# EAGLE design Arduino_MEGA2560 shield new (EAGLE 7.1.0)
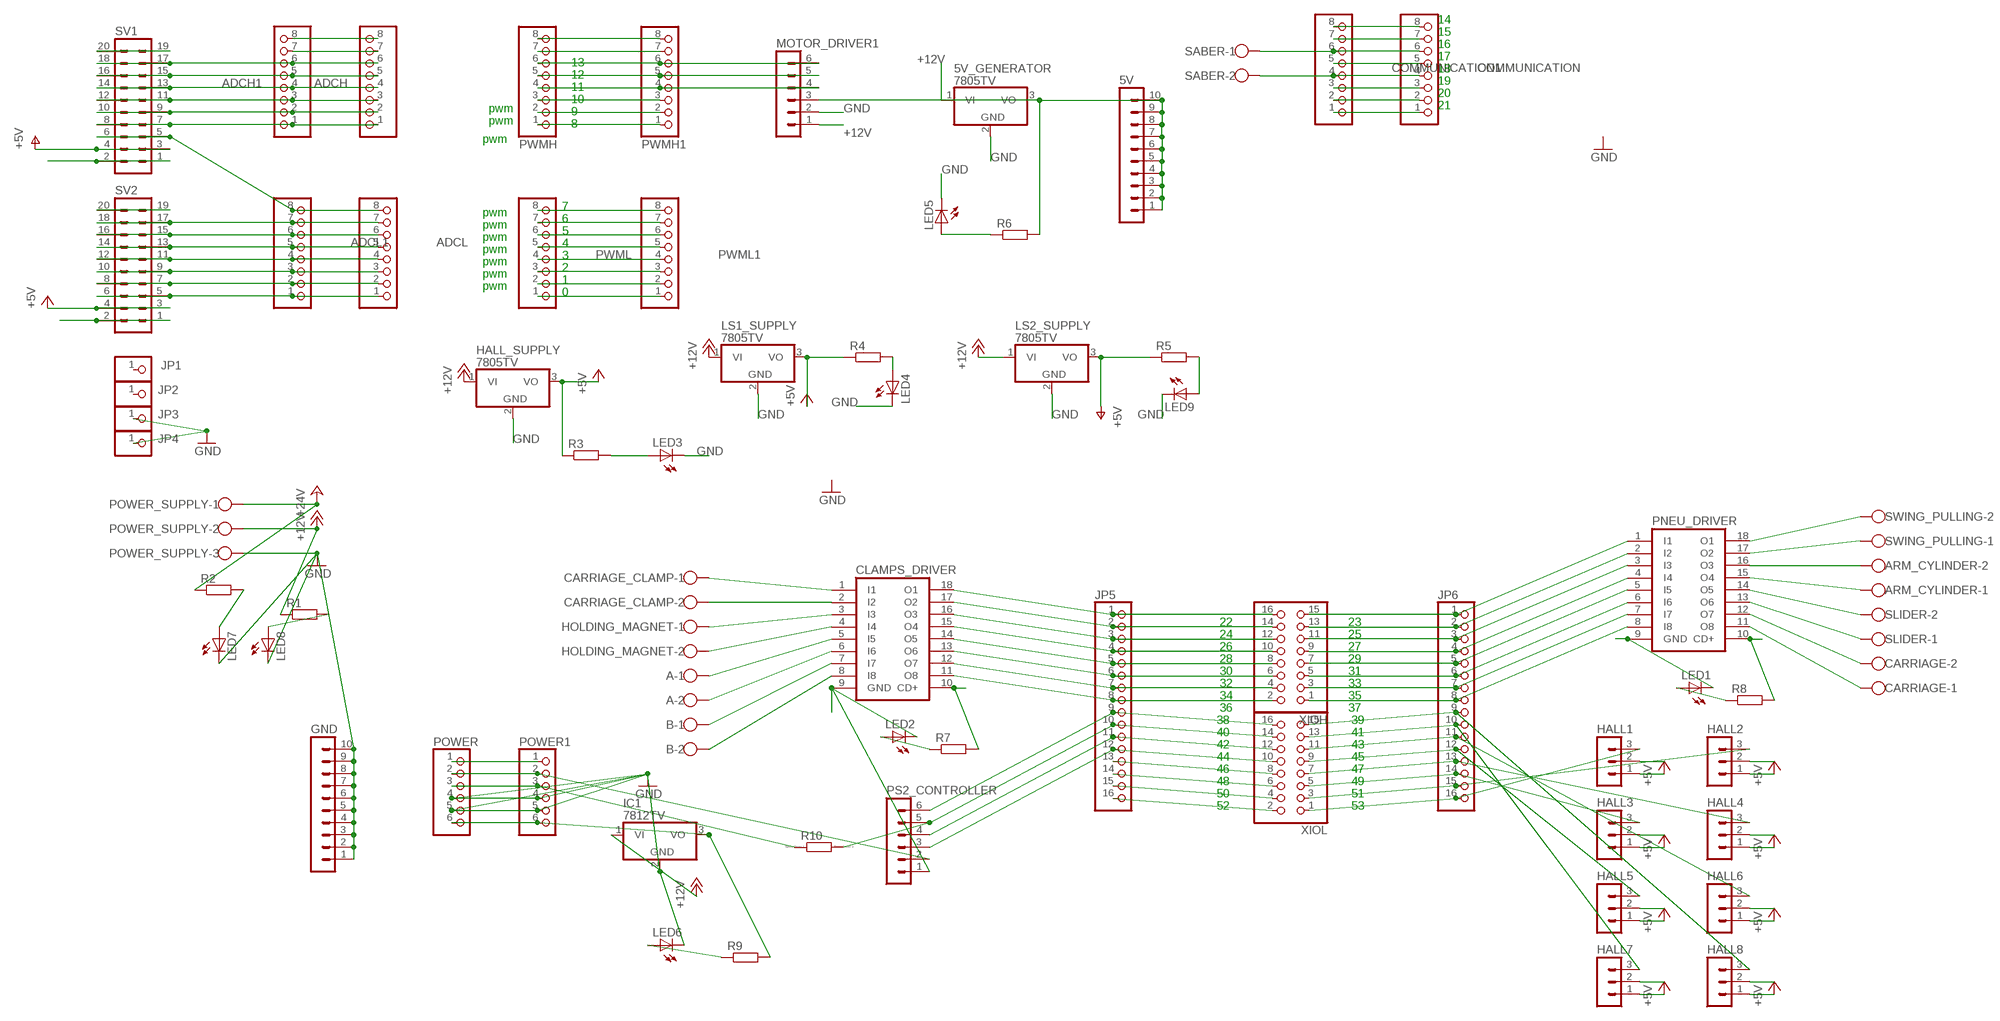
[diagram p0: schematic, sheet 1]

## Parts
5V  MA10-1  [MA10-1]
5V_GENERATOR  7805TV  [TO220V]
A  W237-102  [W237-102]
ADCH  PINHD-1X8  [1X08]
ADCH1  PINHD-1X8  [1X08]
ADCL  PINHD-1X8  [1X08]
ADCL1  PINHD-1X8  [1X08]
ARM_CYLINDER  W237-102  [W237-102]
B  W237-102  [W237-102]
CARRIAGE  W237-102  [W237-102]
CARRIAGE_CLAMP  W237-102  [W237-102]
CLAMPS_DRIVER  ULN2803A  [DIL18]
COMMUNICATION  PINHD-1X8  [1X08]
COMMUNICATION1  PINHD-1X8  [1X08]
GND  MA10-1  [MA10-1]
HALL1  MA03-1  [MA03-1]
HALL2  MA03-1  [MA03-1]
HALL3  MA03-1  [MA03-1]
HALL4  MA03-1  [MA03-1]
HALL5  MA03-1  [MA03-1]
HALL6  MA03-1  [MA03-1]
HALL7  MA03-1  [MA03-1]
HALL8  MA03-1  [MA03-1]
HALL_SUPPLY  7805TV  [TO220V]
HOLDING_MAGNET  W237-102  [W237-102]
IC1  7812TV  [TO220V]
JP1  PINHD-1X1  [1X01]
JP2  PINHD-1X1  [1X01]
JP3  PINHD-1X1  [1X01]
JP4  PINHD-1X1  [1X01]
JP5  PINHD-1X16  [1X16]
JP6  PINHD-1X16  [1X16]
LED1  LEDSML1206  [SML1206]
LED2  LEDSML1206  [SML1206]
LED3  LEDSML1206  [SML1206]
LED4  LEDSML1206  [SML1206]
LED5  LEDSML1206  [SML1206]
LED6  LEDSML1206  [SML1206]
LED7  LEDSML1206  [SML1206]
LED8  LEDSML1206  [SML1206]
LED9  LEDSML1206  [SML1206]
LS1_SUPPLY  7805TV  [TO220V]
LS2_SUPPLY  7805TV  [TO220V]
MOTOR_DRIVER1  MA06-1  [MA06-1]
PNEU_DRIVER  ULN2803A  [DIL18]
POWER  PINHD-1X6  [1X06]
POWER1  PINHD-1X6  [1X06]
POWER_SUPPLY  W237-103  [W237-103]
PS2_CONTROLLER  MA06-1  [MA06-1]
PWMH  PINHD-1X8  [1X08]
PWMH1  PINHD-1X8  [1X08]
PWML  PINHD-1X8  [1X08]
PWML1  PINHD-1X8  [1X08]
R1  R-EU_R0805  [R0805]
R2  R-EU_R0805  [R0805]
R3  R-EU_R0805  [R0805]
R4  R-EU_R0805  [R0805]
R5  R-EU_R0805  [R0805]
R6  R-EU_R0805  [R0805]
R7  R-EU_R0805  [R0805]
R8  R-EU_R0805  [R0805]
R9  R-EU_R0805  [R0805]
R10  R0204/7  [0204/7]
SABER  W237-102  [W237-102]
SLIDER  W237-102  [W237-102]
SV1  MA10-2  [MA10-2]
SV2  MA10-2  [MA10-2]
SWING_PULLING  W237-102  [W237-102]
XIOH  PINHD-2X8  [2X08]
XIOL  PINHD-2X8  [2X08]

## Nets
+5V [Power]: HALL1.1 HALL2.1 HALL3.1 HALL4.1 HALL5.1 HALL6.1 HALL7.1 HALL8.1 HALL_SUPPLY.3(VO) R3.1
+12V [Power]: 5V_GENERATOR.1(VI) HALL_SUPPLY.1(VI) IC1.1(VI) LS1_SUPPLY.1(VI) LS2_SUPPLY.1(VI) MOTOR_DRIVER1.1 POWER_SUPPLY.2 R1.1
+24V [Power]: CLAMPS_DRIVER.10(CD+) PNEU_DRIVER.10(CD+) POWER_SUPPLY.1 R2.1 R7.2 R8.2
GND [GND]: 5V_GENERATOR.2(GND) CLAMPS_DRIVER.9(GND) GND.1 GND.2 GND.3 GND.4 GND.5 GND.6 GND.7 GND.8 GND.9 GND.10 HALL1.2 HALL2.2 HALL3.2 HALL4.2 HALL5.2 HALL6.2 HALL7.2 HALL8.2 HALL_SUPPLY.2(GND) IC1.2(GND) JP3.1 JP4.1 LED1.C LED2.C LED3.C LED4.C LED5.C LED6.C LED7.C LED8.C LED9.C LS1_SUPPLY.2(GND) LS2_SUPPLY.2(GND) MOTOR_DRIVER1.2 PNEU_DRIVER.9(GND) POWER1.4 POWER1.5 POWER.4 POWER.5 POWER_SUPPLY.3 PS2_CONTROLLER.1 SV1.1 SV1.2 SV2.1 SV2.2
N$1: PWMH1.1 PWMH.1
N$2: PWMH1.2 PWMH.2
N$3: PWMH1.3 PWMH.3
N$4: MOTOR_DRIVER1.4 PWMH1.4 PWMH.4
N$5: MOTOR_DRIVER1.5 PWMH1.5 PWMH.5
N$6: MOTOR_DRIVER1.6 PWMH1.6 PWMH.6
N$7: PWMH1.7 PWMH.7
N$8: PWMH1.8 PWMH.8
N$9: ADCH1.8 ADCH.8
N$11: ADCH1.6 ADCH.6 SV1.17 SV1.18
N$12: ADCH1.5 ADCH.5 SV1.15 SV1.16
N$13: ADCH1.4 ADCH.4 SV1.13 SV1.14
N$14: ADCH1.3 ADCH.3 SV1.11 SV1.12
N$15: ADCH1.2 ADCH.2 SV1.9 SV1.10
N$16: ADCH1.1 ADCH.1 SV1.7 SV1.8
N$17: POWER1.1 POWER.1
N$18: POWER1.2 POWER.2 PS2_CONTROLLER.2
N$19: POWER1.3 POWER.3 R10.1
N$20 [Power]: IC1.3(VO) POWER1.6 POWER.6 R9.2
N$21: LED7.A R2.2
N$22: PNEU_DRIVER.18(O1) SWING_PULLING.2
N$23: COMMUNICATION1.8 COMMUNICATION.8
N$24: COMMUNICATION1.7 COMMUNICATION.7
N$25: COMMUNICATION1.6 COMMUNICATION.6 SABER.1
N$26: COMMUNICATION1.5 COMMUNICATION.5
N$27: COMMUNICATION1.4 COMMUNICATION.4 SABER.2
N$28: COMMUNICATION1.3 COMMUNICATION.3
N$29: COMMUNICATION1.2 COMMUNICATION.2
N$30: COMMUNICATION1.1 COMMUNICATION.1
N$31: PWML1.8 PWML.8
N$32: PWML1.7 PWML.7
N$33: PWML1.6 PWML.6
N$34: PWML1.5 PWML.5
N$35: PWML1.4 PWML.4
N$36: PWML1.3 PWML.3
N$37: PWML1.2 PWML.2
N$38: PWML1.1 PWML.1
N$39: ADCL1.8 ADCL.8 SV1.5 SV1.6
N$40: ADCL1.7 ADCL.7 SV2.17 SV2.18
N$42: ADCL1.5 ADCL.5 SV2.13 SV2.14
N$44: ADCL1.3 ADCL.3 SV2.9 SV2.10
N$45: ADCL1.2 ADCL.2 SV2.7 SV2.8
N$46: ADCL1.1 ADCL.1 SV2.5 SV2.6
N$47: CLAMPS_DRIVER.18(O1) JP5.1 XIOH.16
N$48: CLAMPS_DRIVER.17(O2) JP5.2 XIOH.14
N$49: CLAMPS_DRIVER.16(O3) JP5.3 XIOH.12
N$50: CLAMPS_DRIVER.15(O4) JP5.4 XIOH.10
N$51: CLAMPS_DRIVER.14(O5) JP5.5 XIOH.8
N$52: CLAMPS_DRIVER.13(O6) JP5.6 XIOH.6
N$53: CLAMPS_DRIVER.12(O7) JP5.7 XIOH.4
N$54: JP5.12 PS2_CONTROLLER.3 XIOL.10
N$55: JP5.9 PS2_CONTROLLER.6 XIOL.16
N$56: JP5.10 PS2_CONTROLLER.5 R10.2 XIOL.14
N$57: JP5.11 PS2_CONTROLLER.4 XIOL.12
N$58: JP5.13 XIOL.8
N$59: JP5.14 XIOL.6
N$60: JP5.15 XIOL.4
N$61: JP6.1 PNEU_DRIVER.1(I1) XIOH.15
N$62: JP6.2 PNEU_DRIVER.2(I2) XIOH.13
N$63: JP6.3 PNEU_DRIVER.3(I3) XIOH.11
N$64: JP6.4 PNEU_DRIVER.4(I4) XIOH.9
N$65: JP6.5 PNEU_DRIVER.5(I5) XIOH.7
N$66: JP6.6 PNEU_DRIVER.6(I6) XIOH.5
N$67: JP6.7 PNEU_DRIVER.7(I7) XIOH.3
N$68: JP6.8 PNEU_DRIVER.8(I8) XIOH.1
N$69: HALL8.3 JP6.9 XIOL.15
N$70: HALL7.3 JP6.10 XIOL.13
N$71: HALL6.3 JP6.11 XIOL.11
N$72: HALL5.3 JP6.12 XIOL.9
N$73: HALL4.3 JP6.13 XIOL.7
N$74: HALL3.3 JP6.14 XIOL.5
N$75: JP5.16 XIOL.2
N$76: HALL1.3 JP6.16 XIOL.1
N$77: HALL2.3 JP6.15 XIOL.3
N$78: CLAMPS_DRIVER.11(O8) JP5.8 XIOH.2
N$79: CARRIAGE_CLAMP.1 CLAMPS_DRIVER.1(I1)
N$80: PNEU_DRIVER.17(O2) SWING_PULLING.1
N$81: ARM_CYLINDER.2 PNEU_DRIVER.16(O3)
N$82: ARM_CYLINDER.1 PNEU_DRIVER.15(O4)
N$83: PNEU_DRIVER.14(O5) SLIDER.2
N$84: PNEU_DRIVER.13(O6) SLIDER.1
N$85: CARRIAGE.2 PNEU_DRIVER.12(O7)
N$86: CARRIAGE.1 PNEU_DRIVER.11(O8)
N$87: CARRIAGE_CLAMP.2 CLAMPS_DRIVER.2(I2)
N$88: CLAMPS_DRIVER.3(I3) HOLDING_MAGNET.1
N$89: CLAMPS_DRIVER.4(I4) HOLDING_MAGNET.2
N$90: A.1 CLAMPS_DRIVER.5(I5)
N$91: A.2 CLAMPS_DRIVER.6(I6)
N$92: B.1 CLAMPS_DRIVER.7(I7)
N$93: B.2 CLAMPS_DRIVER.8(I8)
N$96: LED8.A R1.2
N$97: LED3.A R3.2
N$98: LED4.A R4.2
N$99: LED9.A R5.2
N$100: 5V.1 5V.2 5V.3 5V.4 5V.5 5V.6 5V.7 5V.8 5V.9 5V.10 5V_GENERATOR.3(VO) MOTOR_DRIVER1.3 R6.2
N$101: LED5.A R6.1
N$102: LED6.A R9.1
N$103: LED1.A R8.1
N$104: LED2.A R7.1
N$105: ADCH1.7 ADCH.7
N$110: SV2.19 SV2.20
N$111: SV1.19 SV1.20
N$114: ADCL1.6 ADCL.6 SV2.15 SV2.16
N$116: ADCL1.4 ADCL.4 SV2.11 SV2.12
V+ [Power]: LS2_SUPPLY.3(VO) R5.1 SV1.3 SV1.4 ; supply symbol labelled +5V
VCC [Power]: LS1_SUPPLY.3(VO) R4.1 SV2.3 SV2.4 ; supply symbol labelled +5V
Unconnected: JP1.1 JP2.1

## Notes on the sheet
- 14
- 15
- 16
- 17
- 13
- 18
- 12
- 19
- 11
- 20
- 10
- pwm | 21
- 9
- pwm | 8
- pwm
- 7
- pwm
- 6
- pwm
- 5
- pwm
- 4
- pwm
- 3
- pwm
- 2
- pwm
- 1
- pwm
- 0
- 22 | 23
- 24 | 25
- 26 | 27
- 28 | 29
- 30 | 31
- 32 | 33
- 34 | 35
- 36 | 37
- 38 | 39
- 40 | 41
- 42 | 43
- 44 | 45
- 46 | 47
- 48 | 49
- 50 | 51
- 52 | 53

## Library data of the parts
5V GND = con-lstb:MA10-1: PIN HEADER; OC_FARNELL: unknown; OC_NEWARK: unknown
5V_GENERATOR HALL_SUPPLY IC1 LS1_SUPPLY LS2_SUPPLY = linear:78*: Positive VOLTAGE REGULATOR Source: http://cache.national.com/ds/LM/LM78L05.pdf http://www.fairchildsemi.com/ds/LM/LM7805.pdf
A ARM_CYLINDER B CARRIAGE CARRIAGE_CLAMP HOLDING_MAGNET SABER SLIDER SWING_PULLING = con-wago-500:W237-102: WAGO SCREW CLAMP; MPN: 237-102; OC_FARNELL: unknown; OC_NEWARK: 70K9898
ADCH ADCH1 ADCL ADCL1 COMMUNICATION COMMUNICATION1 PWMH PWMH1 PWML PWML1 = pinhead:PINHD-1X8: PIN HEADER
CLAMPS_DRIVER PNEU_DRIVER = uln-udn:ULN2803A: DRIVER ARRAY
HALL1-HALL8 = con-lstb:MA03-1: PIN HEADER; OC_FARNELL: unknown; OC_NEWARK: unknown
JP1-JP4 = pinhead:PINHD-1X1: PIN HEADER
JP5 JP6 = pinhead:PINHD-1X16: PIN HEADER
LED1-LED9 = led:LED: LED OSRAM: - CHIPLED LG R971, LG N971, LY N971, LG Q971, LY Q971, LO R971, LY R971 LH N974, LH R974 LS Q976, LO Q976, LY Q976 LO Q996 - Hyper CHIPLED LW Q18S LB Q993, LB Q99A, LB R99A - SideLED LS A670, LO A670, LY A670, LG A670, LP A670 LB A673, LV A673, LT A673, LW A673 LH A674 LY A675 LS A676, LA A676, LO A676, LY A676, LW A676 LS A679, LY A679, LG A679 - Hyper Micro SIDELED® LS Y876, LA Y876, LO Y876, LY Y876 LT Y87S - SmartLED LW L88C, LW L88S LB L89C, LB L89S, LG L890 LS L89K, LO L89K, LY L89K LS L896, LA L896, LO L896, LY L896 - TOPLED LS T670, LO T670, LY T670, LG T670, LP T670 LSG T670, LSP T670, LSY T670, LOP T670, LYG T670 LG T671, LOG T671, LSG T671 LB T673, LV T673, LT T673, LW T673 LH T674 LS T676, LA T676, LO T676, LY T676, LB T676, LH T676, LSB T676, LW T676 LB T67C, LV T67C, LT T67C, LS T67K, LO T67K, LY T67K, LW E67C LS E67B, LA E67B, LO E67B, LY E67B, LB E67C, LV E67C, LT E67C LW T67C LS T679, LY T679, LG T679 LS T770, LO T770, LY T770, LG T770, LP T770 LB T773, LV T773, LT T773, LW T773 LH T774 LS E675, LA E675, LY E675, LS T675 LS T776, LA T776, LO T776, LY T776, LB T776 LHGB T686 LT T68C, LB T68C - Hyper Mini TOPLED® LB M676 - Mini TOPLED Santana® LG M470 LS M47K, LO M47K, LY M47K Source: http://www.osram.convergy.de LUXEON: - LUMILED® LXK2-PW12-R00, LXK2-PW12-S00, LXK2-PW14-U00, LXK2-PW14-V00 LXK2-PM12-R00, LXK2-PM12-S00, LXK2-PM14-U00 LXK2-PE12-Q00, LXK2-PE12-R00, LXK2-PE12-S00, LXK2-PE14-T00, LXK2-PE14-U00 LXK2-PB12-K00, LXK2-PB12-L00, LXK2-PB12-M00, LXK2-PB14-N00, LXK2-PB14-P00, LXK2-PB14-Q00 LXK2-PR12-L00, LXK2-PR12-M00, LXK2-PR14-Q00, LXK2-PR14-R00 LXK2-PD12-Q00, LXK2-PD12-R00, LXK2-PD12-S00 LXK2-PH12-R00, LXK2-PH12-S00 LXK2-PL12-P00, LXK2-PL12-Q00, LXK2-PL12-R00 Source: www.luxeon.com KINGBRIGHT: KA-3528ASYC Source: www.kingbright.com
MOTOR_DRIVER1 PS2_CONTROLLER = con-lstb:MA06-1: PIN HEADER; OC_FARNELL: unknown; OC_NEWARK: unknown
POWER POWER1 = pinhead:PINHD-1X6: PIN HEADER
POWER_SUPPLY = con-wago-500:W237-103: WAGO SCREW CLAMP; MPN: 237-103; OC_FARNELL: unknown; OC_NEWARK: 18M7116
R1-R9 = resistor:R-EU_: RESISTOR, European symbol
R10 = eagle-ltspice:R: RESISTOR, European symbol; SPICEMODEL: NONE; SPICEPREFIX: R
SV1 SV2 = con-lstb:MA10-2: PIN HEADER; OC_FARNELL: unknown; OC_NEWARK: unknown
XIOH XIOL = pinhead:PINHD-2X8: PIN HEADER

## Net classes
0 default: width 0.6 mm, drill 0.305 mm, clearance 0.305 mm
1 GND: width 1 mm, drill 0.305 mm, clearance 0.305 mm to class 0, clearance 0.305 mm
2 Power: width 1 mm, drill 0.305 mm, clearance 0.305 mm to class 0, clearance 0.305 mm to class 1, clearance 0.305 mm

## Board
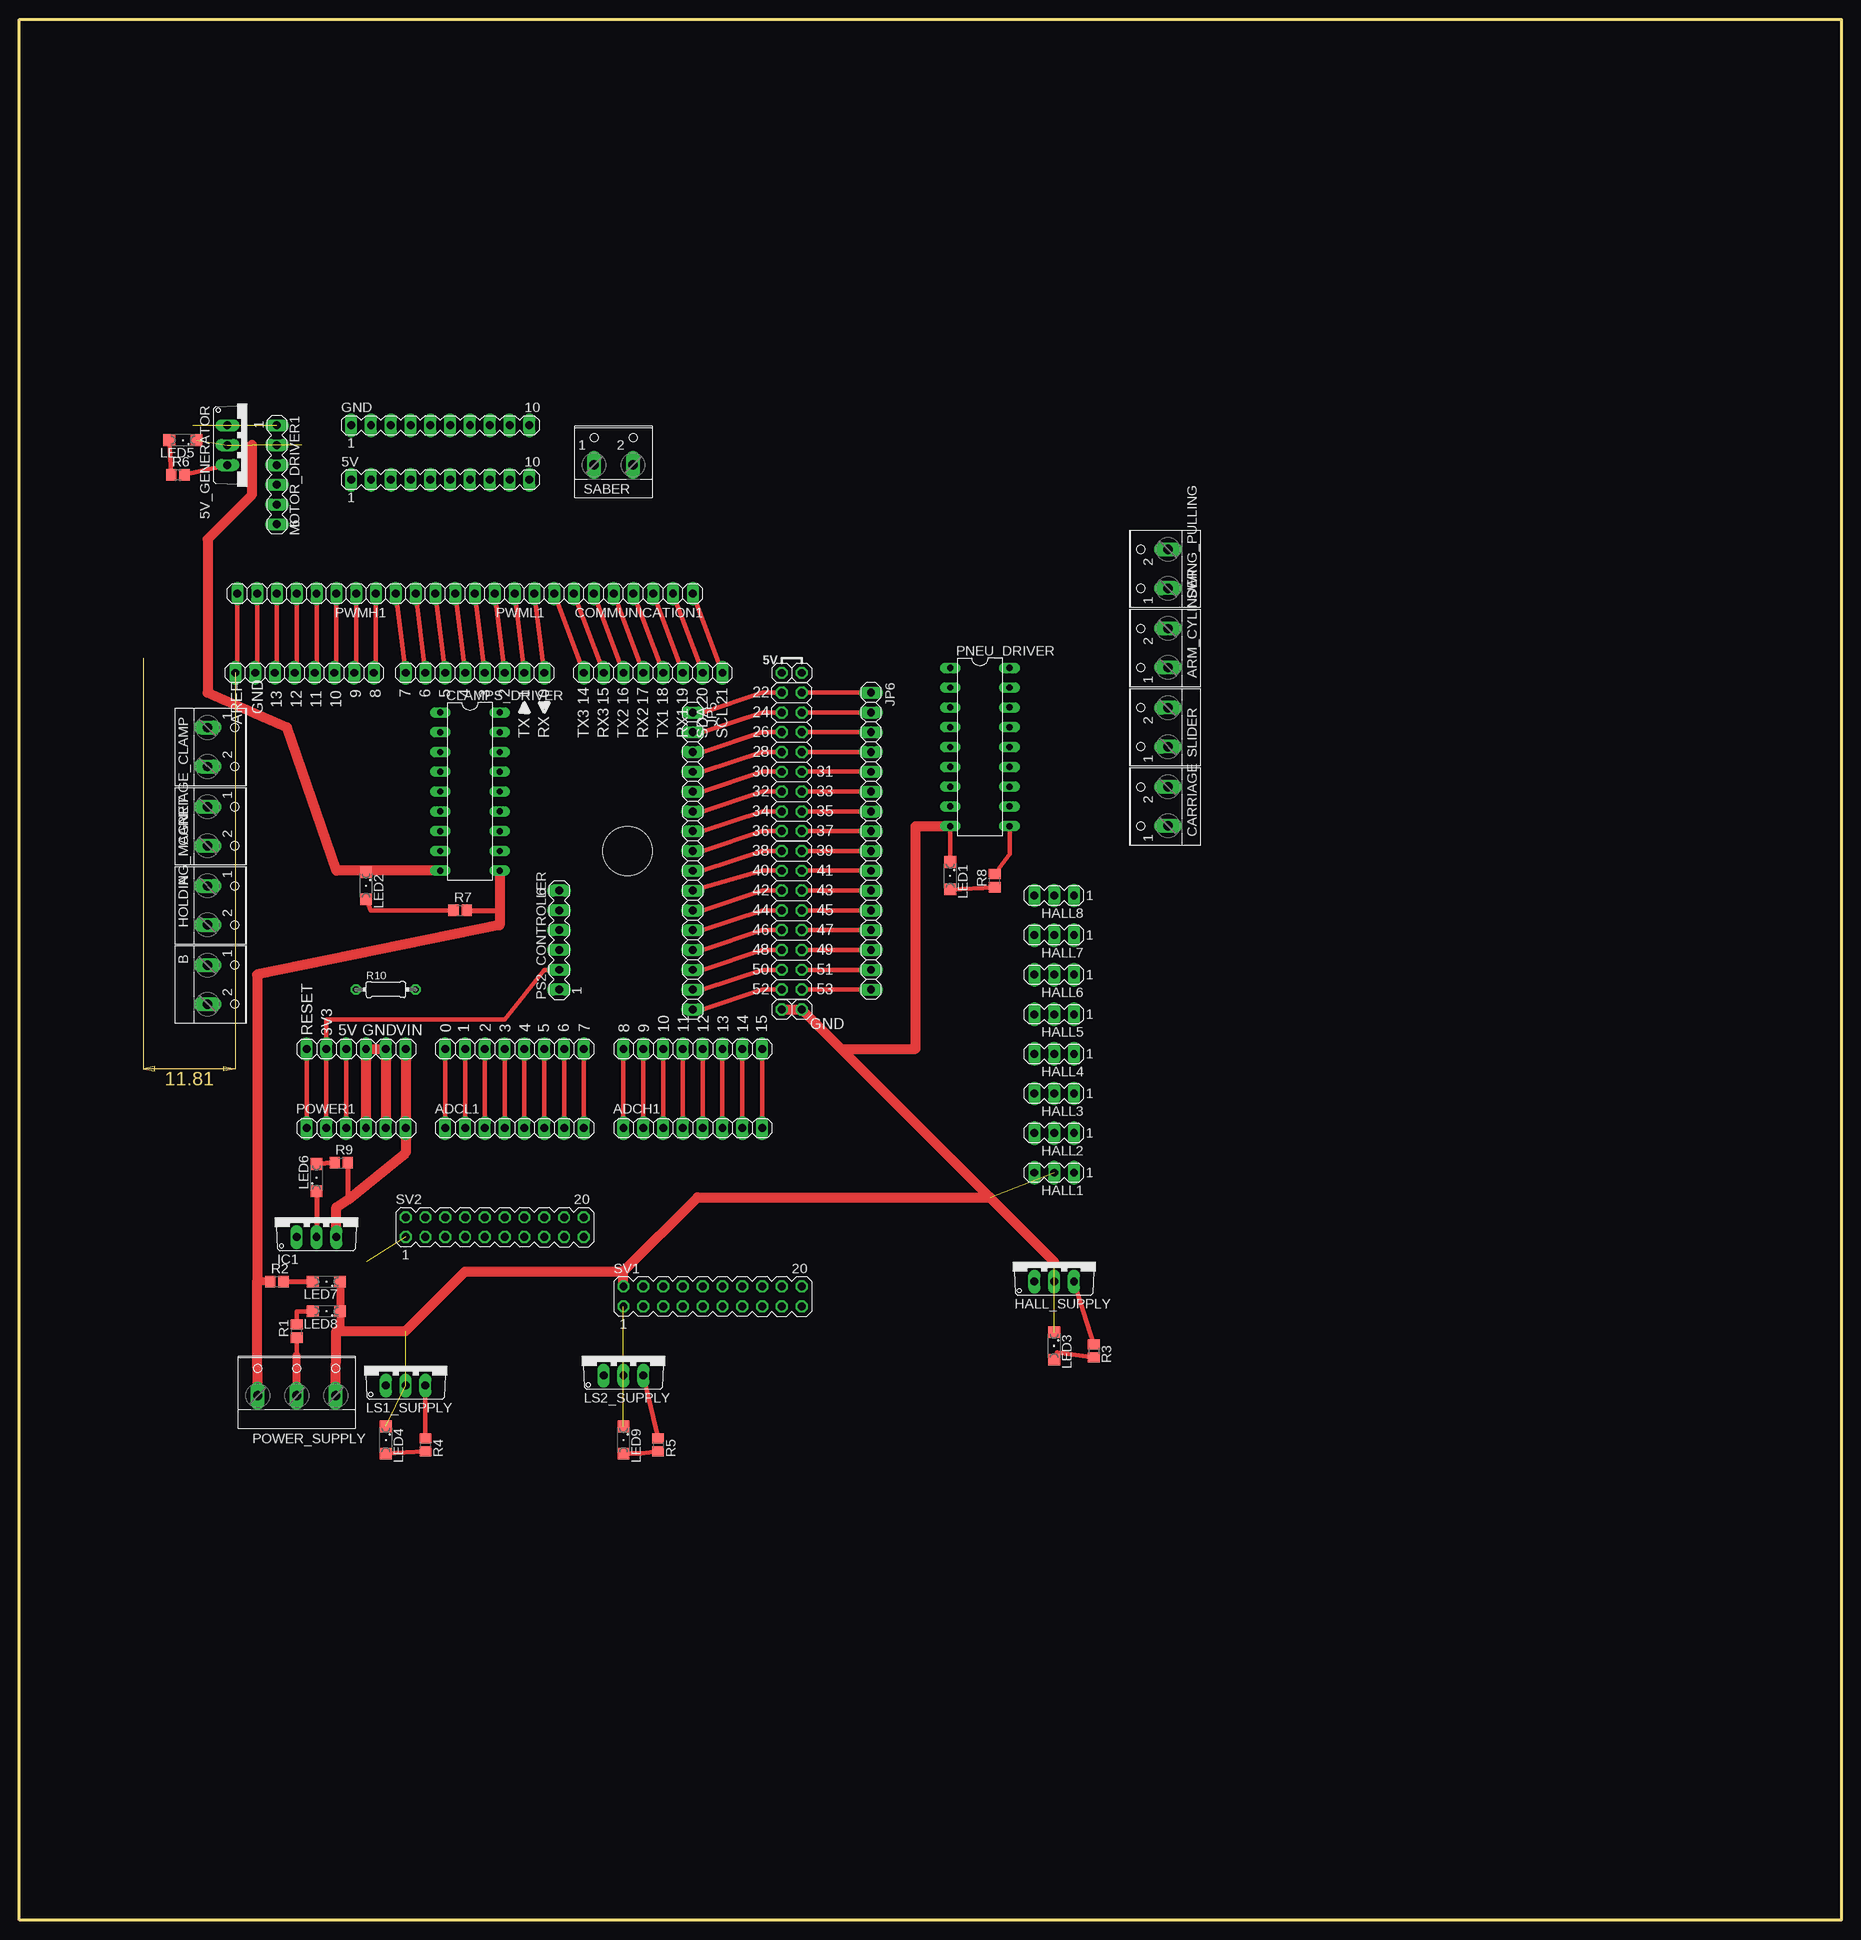
[diagram p1: board, top side]
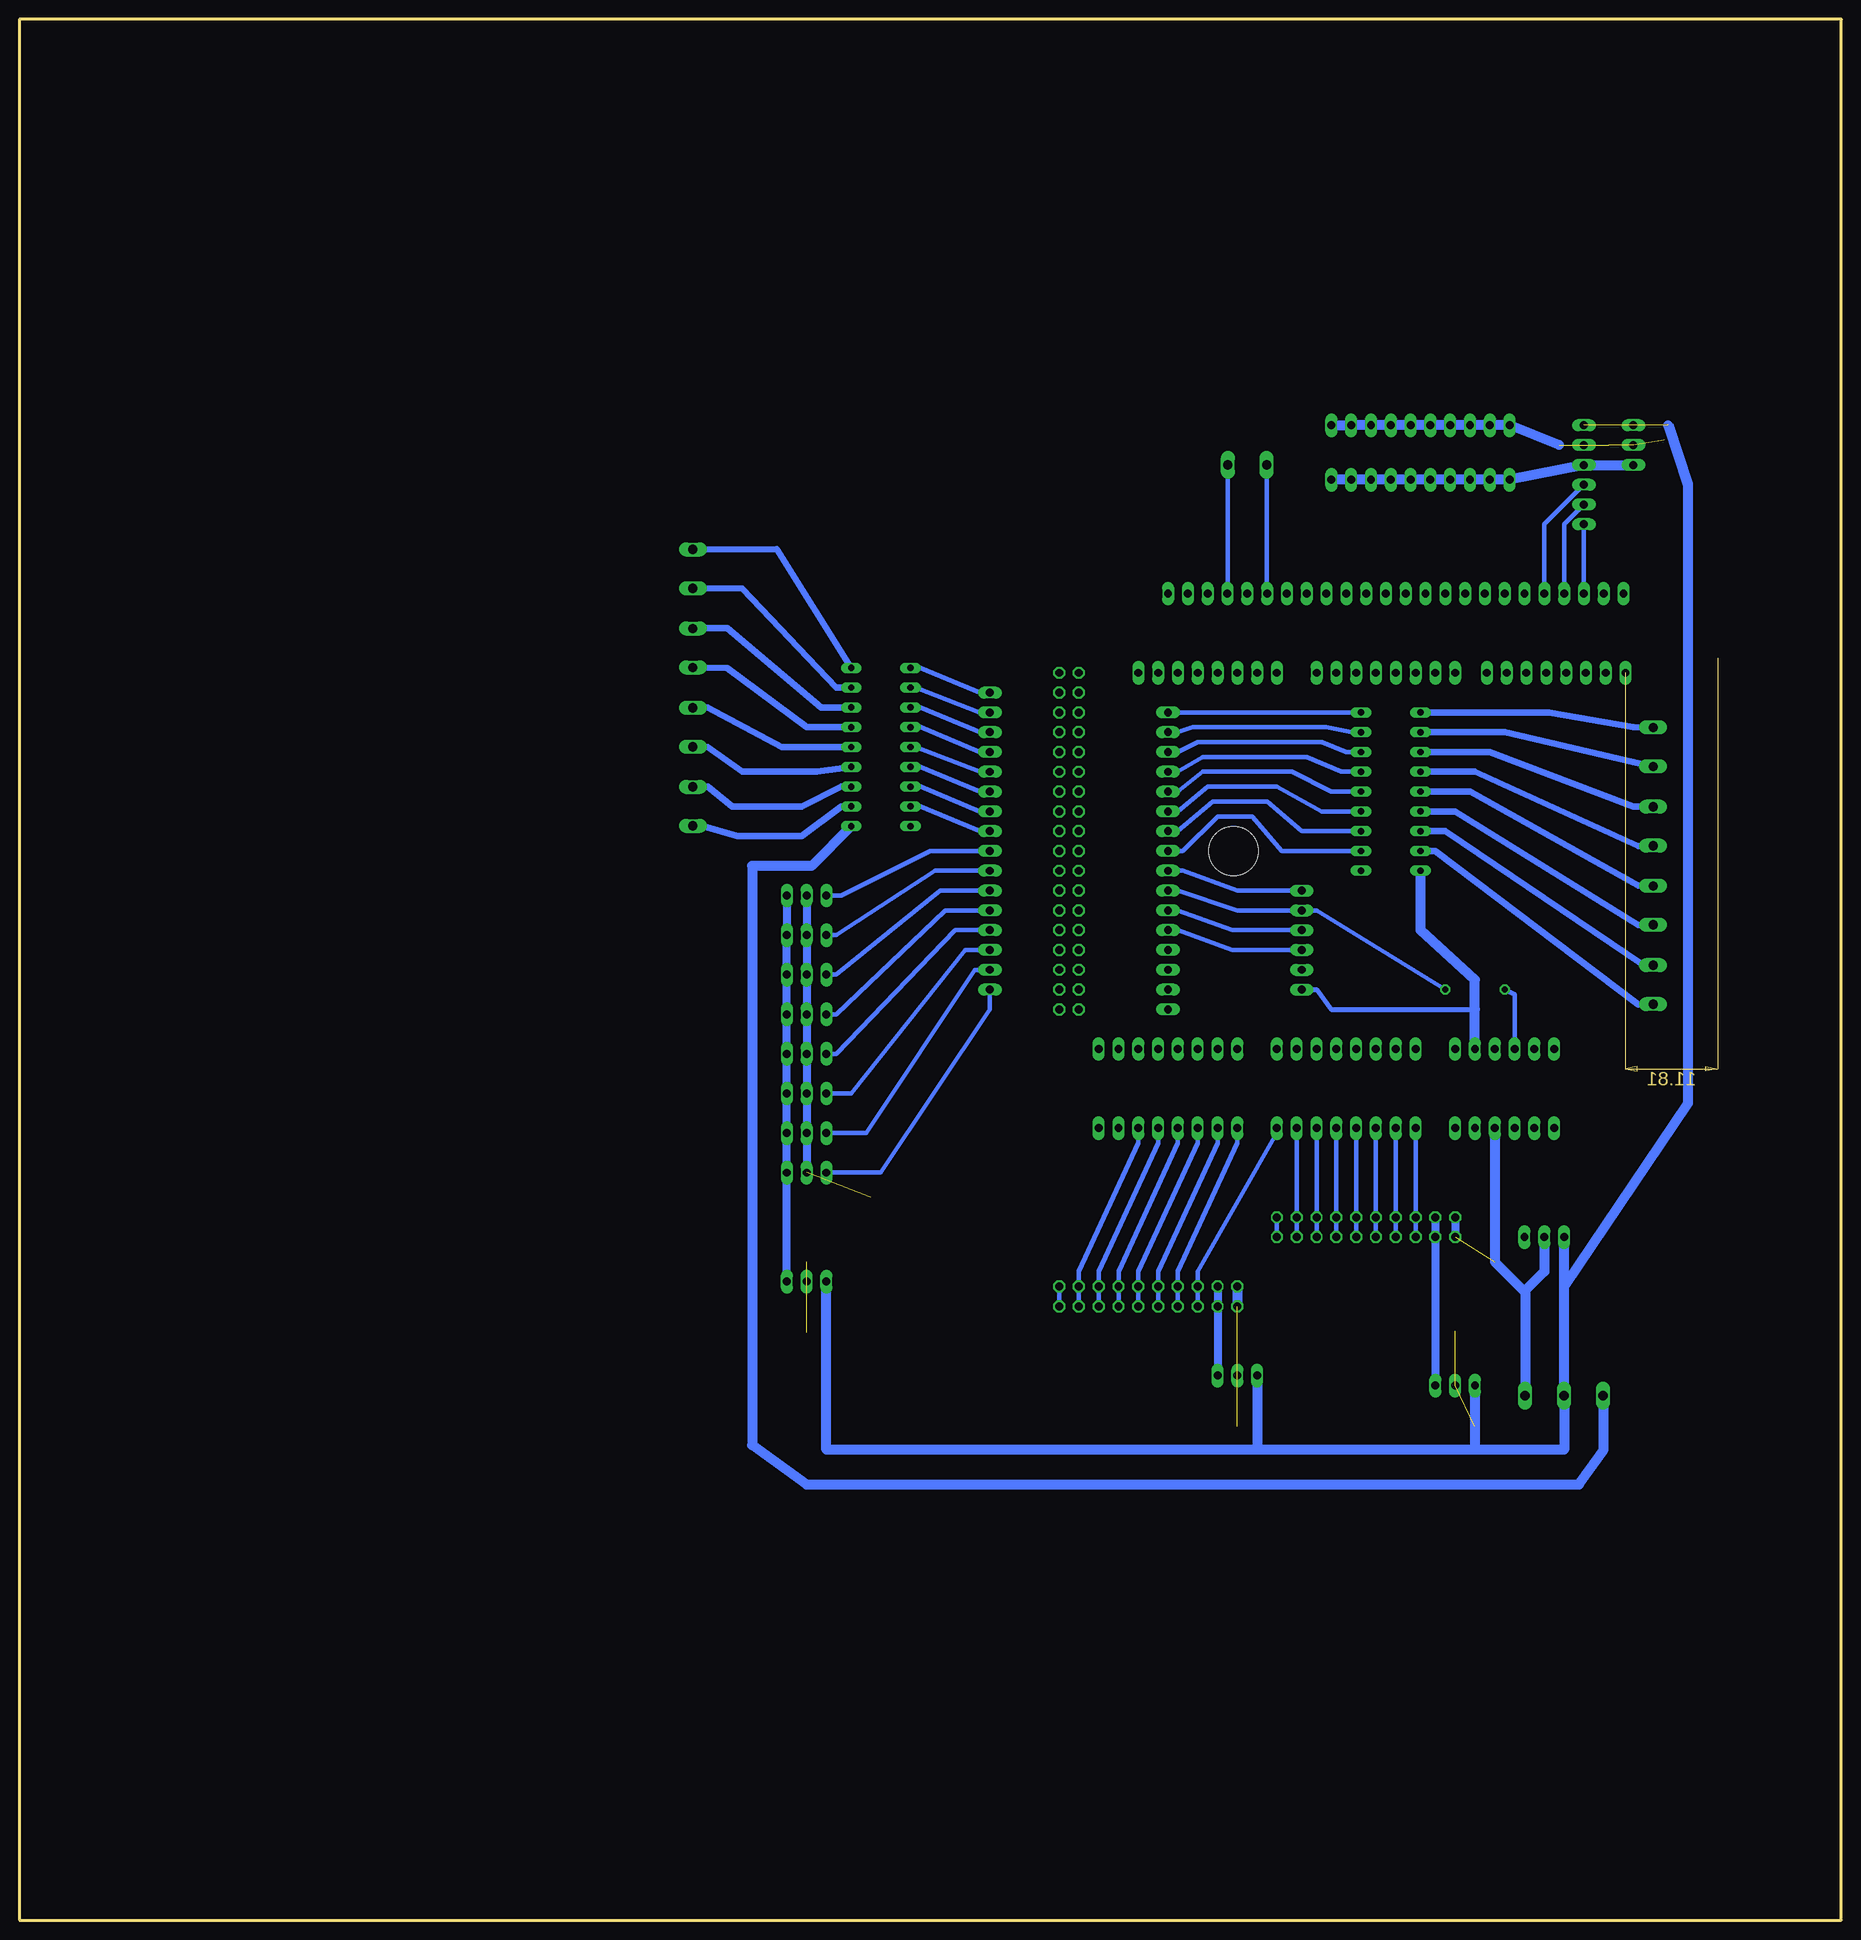
[diagram p2: board, bottom side, seen from below]

Size 233.68 x 243.84 mm. Coordinates in mm from the lower left corner, seen from the top.
Outline: 0,0 0,243.84 233.68,243.84 233.68,0 0,0
Copper layers (1*16): Top 0.035mm / dielectric 1.5mm / Bottom 0.035mm
Design rules "default": minimum track width 6mil, minimum drill 12mil, track to track 6mil, track to pad 6mil, pad to pad 6mil, via to via 6mil, smd to smd 6mil, copper to edge 40mil, drill to drill 12mil, minimum pad ring 10mil, minimum via ring 10mil, stop-mask expansion 2mil, vias tented up to drill 1mil, thermal gap 10mil
Holes 6.35 mm at 77.98,137.16

### Footprints (pad centres in the part's own frame; a part is rotated, then mirrored left to right if it is on the bottom)
MA10-1 = drill 1.016 long: 1 -11.43,0; 2 -8.89,0; 3 -6.35,0; 4 -3.81,0; 5 -1.27,0; 6 1.27,0; 7 3.81,0; 8 6.35,0; 9 8.89,0; 10 11.43,0
TO220V = drill 1.016 long: 1 -2.54,-2.54; 2 0,-2.54; 3 2.54,-2.54
W237-102 = drill 1.194 long: 1 -2.5,-1.27; 2 2.5,-1.27
1X08 = drill 1.016 long: 1 -8.89,0; 2 -6.35,0; 3 -3.81,0; 4 -1.27,0; 5 1.27,0; 6 3.81,0; 7 6.35,0; 8 8.89,0
DIL18 = drill 0.813 long: 1 -10.16,-3.81; 2 -7.62,-3.81; 3 -5.08,-3.81; 4 -2.54,-3.81; 5 0,-3.81; 6 2.54,-3.81; 7 5.08,-3.81; 8 7.62,-3.81; 9 10.16,-3.81; 10 10.16,3.81; 11 7.62,3.81; 12 5.08,3.81; 13 2.54,3.81; 14 0,3.81; 15 -2.54,3.81; 16 -5.08,3.81; 17 -7.62,3.81; 18 -10.16,3.81
MA03-1 = drill 1.016 long: 1 -2.54,0; 2 0,0; 3 2.54,0
1X01 = drill 1.016 octagon: 1 0,0
1X16 = drill 1.016 long: 1 -19.05,0; 2 -16.51,0; 3 -13.97,0; 4 -11.43,0; 5 -8.89,0; 6 -6.35,0; 7 -3.81,0; 8 -1.27,0; 9 1.27,0; 10 3.81,0; 11 6.35,0; 12 8.89,0; 13 11.43,0; 14 13.97,0; 15 16.51,0; 16 19.05,0
SML1206 = smd 1.5 x 1.5: A 1.75,0; C -1.75,0
MA06-1 = drill 1.016 long: 1 -6.35,0; 2 -3.81,0; 3 -1.27,0; 4 1.27,0; 5 3.81,0; 6 6.35,0
1X06 = drill 1.016 long: 1 -6.35,0; 2 -3.81,0; 3 -1.27,0; 4 1.27,0; 5 3.81,0; 6 6.35,0
W237-103 = drill 1.194 long: 1 -5,-1.29; 2 0,-1.29; 3 5,-1.29
R0805 = smd 1.3 x 1.5: 1 -0.85,0; 2 0.85,0
0204/7 = drill 0.813 octagon: 1 -3.81,0; 2 3.81,0
MA10-2 = drill 1.016 octagon: 1 -11.43,-1.27; 2 -11.43,1.27; 3 -8.89,-1.27; 4 -8.89,1.27; 5 -6.35,-1.27; 6 -6.35,1.27; 7 -3.81,-1.27; 8 -3.81,1.27; 9 -1.27,-1.27; 10 -1.27,1.27; 11 1.27,-1.27; 12 1.27,1.27; 13 3.81,-1.27; 14 3.81,1.27; 15 6.35,-1.27; 16 6.35,1.27; 17 8.89,-1.27; 18 8.89,1.27; 19 11.43,-1.27; 20 11.43,1.27
2X08 = drill 1.016 octagon: 1 -8.89,-1.27; 2 -8.89,1.27; 3 -6.35,-1.27; 4 -6.35,1.27; 5 -3.81,-1.27; 6 -3.81,1.27; 7 -1.27,-1.27; 8 -1.27,1.27; 9 1.27,-1.27; 10 1.27,1.27; 11 3.81,-1.27; 12 3.81,1.27; 13 6.35,-1.27; 14 6.35,1.27; 15 8.89,-1.27; 16 8.89,1.27

### Placement (x,y rotation side)
5V  53.97,184.78 0 top
5V_GENERATOR  29.21,189.23 270 top
A  25.4,130.18 270 top
ADCH  86.36,111.76 0 top
ADCH1  86.36,101.6 0 top
ADCL  63.5,111.76 0 top
ADCL1  63.5,101.6 0 top
ARM_CYLINDER  146.05,163.19 90 top
B  25.4,120.02 270 top
CARRIAGE  146.05,142.88 90 top
CARRIAGE_CLAMP  25.4,150.5 270 top
CLAMPS_DRIVER  57.78,144.78 270 top
COMMUNICATION  81.28,160.02 180 top
COMMUNICATION1  77.47,170.18 180 top
GND  53.97,191.77 0 top
HALL1  132.72,95.88 180 top
HALL2  132.72,100.97 180 top
HALL3  132.72,106.05 180 top
HALL4  132.72,111.12 180 top
HALL5  132.72,116.2 180 top
HALL6  132.72,121.28 180 top
HALL7  132.72,126.37 180 top
HALL8  132.72,131.44 180 top
HALL_SUPPLY  132.72,84.45 0 top
HOLDING_MAGNET  25.4,140.34 270 top
IC1  38.1,90.17 0 top
JP1  97.79,160.02 0 top
JP2  100.33,160.02 0 top
JP3  97.79,116.84 0 top
JP4  100.33,116.84 0 top
JP5  86.36,135.89 270 top
JP6  109.22,138.43 270 top
LED1  119.38,133.98 270 top
LED2  44.45,132.72 270 top
LED3  132.72,73.66 270 top
LED4  46.99,61.59 270 top
LED5  20.96,189.87 180 top
LED6  38.1,95.25 90 top
LED7  39.37,81.91 180 top
LED8  39.37,78.1 180 top
LED9  77.47,61.59 270 top
LS1_SUPPLY  49.53,71.12 0 top
LS2_SUPPLY  77.47,72.39 0 top
MOTOR_DRIVER1  33.02,185.42 270 top
PNEU_DRIVER  123.19,150.5 270 top
POWER  43.18,111.76 0 top
POWER1  43.18,101.6 0 top
POWER_SUPPLY  35.56,68.58 0 top
PS2_CONTROLLER  69.22,125.73 90 top
PWMH  36.58,160.02 180 top
PWMH1  36.83,170.18 180 top
PWML  58.42,160.02 180 top
PWML1  57.15,170.18 180 top
R1  35.56,75.56 90 top
R2  33.02,81.91 0 top
R3  137.79,73.03 270 top
R4  52.07,60.96 270 top
R5  81.92,60.96 270 top
R6  20.32,185.42 0 top
R7  56.51,129.54 0 top
R8  125.09,133.35 90 top
R9  41.27,97.16 0 top
R10  46.99,119.38 0 top
SABER  76.2,187.96 0 top
SLIDER  146.05,153.03 90 top
SV1  88.9,80.01 0 top
SV2  60.96,88.9 0 top
SWING_PULLING  146.05,173.35 90 top
XIOH  99.06,148.59 90 top
XIOL  99.06,128.27 90 top

### Tracks (layer width: path | path; a pad name or v marks a point on that pad's centre or on a via)
+5V
  Top 0.6: HALL_SUPPLY.3 R3.1
  Bottom 1: HALL_SUPPLY.3 HALL1.1 HALL2.1 HALL3.1 HALL4.1 HALL5.1 HALL6.1 HALL7.1 HALL8.1
+12V  (2 unrouted)
  Top 0.6: 35.56,72.39 R1.1
  Top 1: POWER_SUPPLY.2 35.56,72.39
  Bottom 1.27: 35.56,81.28 POWER_SUPPLY.2 35.56,60.32 46.99,60.32 | 35.56,81.28 IC1.1 | 46.99,60.32 74.93,60.32 | 74.93,60.32 130.17,60.32 HALL_SUPPLY.1 | LS2_SUPPLY.1 74.93,60.32 | LS1_SUPPLY.1 46.99,60.32 | 22.23,191.77 19.68,184.15 19.68,104.78 35.56,81.28
+24V
  Top 0.6: R8.2 127,136.74 PNEU_DRIVER.10
  Top 0.61: R7.2 61.59,129.54
  Top 1: R2.1 30.48,81.91
  Top 1.27: POWER_SUPPLY.1 30.48,74.3 30.48,81.91 30.48,121.28 61.59,127.63 61.59,129.54 CLAMPS_DRIVER.10
  Bottom 1: 30.48,66.67 30.56,66.75 POWER_SUPPLY.1
  Bottom 1.27: PNEU_DRIVER.10 132.08,135.25 139.7,135.25 139.7,60.96 132.72,55.88 33.65,55.88 30.48,60.32 30.48,66.67
GND  (12 unrouted)
  Top 0.6: PNEU_DRIVER.9 LED1.C
  Top 0.61: LED6.C IC1.2
  Top 1: LED2.C 44.45,134.62 | 40.64,75.56 41.27,75.56 41.12,75.72 LED8.C LED7.C
  Top 1.27: POWER1.5 POWER.5 POWER.4 POWER1.4 | JP3.1 JP4.1 105.41,111.76 | 105.41,111.76 114.94,111.76 114.94,140.34 PNEU_DRIVER.9 | 132.72,84.45 124.46,92.71 | 124.46,92.71 105.41,111.76 | SV1.2 77.47,83.19 | 77.47,83.19 87,92.71 124.46,92.71 | 77.47,83.19 57.15,83.19 49.53,75.56 41.27,75.56 | CLAMPS_DRIVER.9 44.45,134.62 40.64,134.62 34.29,153.03 24.13,157.48 24.13,177.16 29.84,182.88 29.84,189.23 | POWER_SUPPLY.3 40.64,75.56
  Bottom 0.61: PS2_CONTROLLER.1 67.31,119.38 65.41,116.84 46.99,116.84
  Bottom 1: HALL8.2 HALL7.2 HALL6.2 HALL5.2 HALL4.2 HALL3.2 HALL2.2 HALL1.2 | SV2.2 SV2.1 | 40.64,80.64 40.56,80.56
  Bottom 1.27: SV1.2 SV1.1 | POWER.5 46.99,116.84 46.99,120.65 53.97,127 CLAMPS_DRIVER.9 | GND.10 GND.9 GND.8 GND.7 GND.6 GND.5 GND.4 GND.3 GND.2 GND.1 36.2,189.23 | POWER1.4 44.45,84.45 40.64,80.64 38.1,83.19 IC1.2 | 40.56,80.56 POWER_SUPPLY.3
N$1
  Top 0.6: PWMH1.1 45.72,160.27 PWMH.1
N$2
  Top 0.6: PWMH1.2 43.18,160.27 PWMH.2
N$3
  Top 0.6: PWMH1.3 40.64,160.27 PWMH.3
N$4
  Top 0.6: PWMH1.4 38.1,160.27 PWMH.4
  Bottom 0.6: PWMH1.4 38.1,179.07 MOTOR_DRIVER1.4
N$5
  Top 0.6: PWMH1.5 35.56,160.27 PWMH.5
  Bottom 0.6: PWMH1.5 35.56,179.07 MOTOR_DRIVER1.5
N$6
  Top 0.6: PWMH1.6 33.02,160.27 PWMH.6
  Bottom 0.6: PWMH1.6 MOTOR_DRIVER1.6
N$7
  Top 0.6: PWMH1.7 30.48,160.27 PWMH.7
N$8
  Top 0.6: PWMH1.8 27.94,160.27 PWMH.8
N$9
  Top 0.6: ADCH.8 ADCH1.8
N$11
  Top 0.6: ADCH.6 ADCH1.6
  Bottom 0.6: SV1.17 SV1.18 97.79,83.19 90.17,99.69 ADCH1.6
N$12
  Top 0.6: ADCH.5 ADCH1.5
  Bottom 0.6: SV1.15 SV1.16 95.25,83.19 87.63,99.69 ADCH1.5
N$13
  Top 0.6: ADCH.4 ADCH1.4
  Bottom 0.6: SV1.13 SV1.14 92.71,83.19 85.09,99.69 ADCH1.4
N$14
  Top 0.6: ADCH.3 ADCH1.3
  Bottom 0.6: SV1.11 SV1.12 90.17,83.19 82.55,99.69 ADCH1.3
N$15
  Top 0.6: ADCH.2 ADCH1.2
  Bottom 0.6: SV1.9 SV1.10 87.63,83.19 80.01,99.69 ADCH1.2
N$16
  Top 0.6: ADCH.1 ADCH1.1
  Bottom 0.6: SV1.7 SV1.8 85.09,83.19 77.47,99.69 ADCH1.1
N$17
  Top 0.6: POWER1.1 POWER.1
N$18
  Top 0.6: POWER1.2 POWER.2 39.37,115.57 62.23,115.57 67.31,121.92 PS2_CONTROLLER.2
N$19
  Top 0.6: POWER.3 POWER1.3
  Bottom 0.6: R10.1 41.91,118.75 POWER.3
N$20
  Top 0.61: R9.2 42.12,92.39
  Top 1.27: POWER.6 POWER1.6 49.53,98.42 42.12,92.39 40.64,91.44 IC1.3
N$21
  Top 0.61: R2.2 LED7.A
N$22
  Bottom 0.813: PNEU_DRIVER.18 136.52,175.9 SWING_PULLING.2
N$23
  Top 0.6: COMMUNICATION.8 COMMUNICATION1.8
N$24
  Top 0.6: COMMUNICATION.7 COMMUNICATION1.7
N$25
  Top 0.6: COMMUNICATION.6 COMMUNICATION1.6
  Bottom 0.6: COMMUNICATION1.6 73.7,170.81 SABER.1
N$26
  Top 0.6: COMMUNICATION.5 COMMUNICATION1.5
N$27
  Top 0.6: COMMUNICATION.4 COMMUNICATION1.4
  Bottom 0.6: COMMUNICATION1.4 78.7,172.72 SABER.2
N$28
  Top 0.6: COMMUNICATION.3 COMMUNICATION1.3
N$29
  Top 0.6: COMMUNICATION.2 COMMUNICATION1.2
N$30
  Top 0.6: COMMUNICATION.1 COMMUNICATION1.1
N$31
  Top 0.6: PWML.8 PWML1.8
N$32
  Top 0.6: PWML.7 PWML1.7
N$33
  Top 0.6: PWML.6 PWML1.6
N$34
  Top 0.6: PWML.5 PWML1.5
N$35
  Top 0.6: PWML.4 PWML1.4
N$36
  Top 0.6: PWML.3 PWML1.3
N$37
  Top 0.6: PWML.2 PWML1.2
N$38
  Top 0.6: PWML.1 PWML1.1
N$39
  Top 0.6: ADCL.8 ADCL1.8
  Bottom 0.6: SV1.5 SV1.6 82.55,83.19 72.39,100.97 ADCL1.8
N$40
  Top 0.6: ADCL.7 ADCL1.7
  Bottom 0.6: ADCL1.7 SV2.18 SV2.17
N$42
  Top 0.6: ADCL.5 ADCL1.5
  Bottom 0.6: ADCL1.5 SV2.14 SV2.13
N$44
  Top 0.6: ADCL.3 ADCL1.3
  Bottom 0.6: ADCL1.3 SV2.10 SV2.9
N$45
  Top 0.6: ADCL.2 ADCL1.2
  Bottom 0.6: ADCL1.2 SV2.8 SV2.7
N$46
  Top 0.6: ADCL.1 ADCL1.1
  Bottom 0.6: ADCL1.1 SV2.6 SV2.5
N$47
  Top 0.6: XIOH.16 95.25,157.48 87.63,154.94 JP5.1
  Bottom 0.6: CLAMPS_DRIVER.18 JP5.1
N$48
  Top 0.6: XIOH.14 95.25,154.94 87.63,152.4 JP5.2
  Bottom 0.6: JP5.2 85.09,152.4 83.19,153.03 66.04,153.03 62.87,152.4 CLAMPS_DRIVER.17
N$49
  Top 0.6: JP5.3 87.63,149.86 95.25,152.4 XIOH.12
  Bottom 0.6: CLAMPS_DRIVER.16 63.5,149.86 66.67,151.13 82.55,151.13 85.09,149.86 JP5.3
N$50
  Top 0.6: XIOH.10 95.25,149.86 87.63,147.32 JP5.4
  Bottom 0.6: CLAMPS_DRIVER.15 64.14,147.32 68.58,149.22 81.92,149.22 85.09,147.32 JP5.4
N$51
  Top 0.6: JP5.5 87.63,144.78 95.25,147.32 XIOH.8
  Bottom 0.6: CLAMPS_DRIVER.14 65.41,144.78 70.48,147.32 81.92,147.32 85.09,144.78 JP5.5
N$52
  Top 0.6: XIOH.6 95.25,144.78 87.63,142.24 JP5.6
  Bottom 0.6: CLAMPS_DRIVER.13 66.67,142.24 72.39,145.41 81.28,145.41 85.09,142.24 JP5.6
N$53
  Top 0.6: XIOH.4 95.25,142.24 87.63,139.7 JP5.7
  Bottom 0.6: JP5.7 85.09,139.7 80.65,143.51 73.66,143.51 69.22,139.7 CLAMPS_DRIVER.12
N$54
  Top 0.6: JP5.12 87.63,127 95.25,129.54 XIOL.10
  Bottom 0.6: PS2_CONTROLLER.3 78.11,124.46 85.09,127 JP5.12
N$55
  Top 0.6: JP5.9 87.63,134.62 95.25,137.16 XIOL.16
  Bottom 0.6: PS2_CONTROLLER.6 77.47,132.08 84.45,134.62 JP5.9
N$56
  Top 0.6: JP5.10 95.25,134.62 XIOL.14
  Bottom 0.6: JP5.10 85.09,132.08 77.47,129.54 PS2_CONTROLLER.5 67.31,129.54 R10.2
N$57
  Top 0.6: XIOL.12 95.25,132.08 87.63,129.54 JP5.11
  Bottom 0.6: PS2_CONTROLLER.4 78.11,127 85.09,129.54 JP5.11
N$58
  Top 0.6: XIOL.8 95.25,127 87.63,124.46 JP5.13
N$59
  Top 0.6: JP5.14 87.63,121.92 95.25,124.46 XIOL.6
N$60
  Top 0.6: XIOL.4 95.25,121.92 87.63,119.38 JP5.15
N$61
  Top 0.6: XIOH.15 JP6.1
  Bottom 0.6: JP6.1 110.49,157.48 118.11,160.66 PNEU_DRIVER.1
N$62
  Top 0.6: XIOH.13 JP6.2
  Bottom 0.6: PNEU_DRIVER.2 118.75,158.12 110.49,154.94 JP6.2
N$63
  Top 0.6: XIOH.11 JP6.3
  Bottom 0.6: PNEU_DRIVER.3 118.11,155.57 110.49,152.4 JP6.3
N$64
  Top 0.6: XIOH.9 JP6.4
  Bottom 0.6: JP6.4 110.49,149.86 118.11,153.03 PNEU_DRIVER.4
N$65
  Top 0.6: XIOH.7 JP6.5
  Bottom 0.6: JP6.5 110.49,147.32 118.75,150.5 PNEU_DRIVER.5
N$66
  Top 0.6: XIOH.5 JP6.6
  Bottom 0.6: JP6.6 110.49,144.78 118.11,147.96 PNEU_DRIVER.6
N$67
  Top 0.6: XIOH.3 JP6.7
  Bottom 0.6: JP6.7 110.49,142.24 118.11,145.41 PNEU_DRIVER.7
N$68
  Top 0.6: XIOH.1 JP6.8
  Bottom 0.6: JP6.8 110.49,139.7 118.11,142.88 PNEU_DRIVER.8
N$69
  Top 0.6: XIOL.15 JP6.9
  Bottom 0.6: JP6.9 116.84,137.16 128.27,131.44 HALL8.3
N$70
  Top 0.6: XIOL.13 JP6.10
  Bottom 0.6: HALL7.3 128.91,126.37 116.2,134.62 JP6.10
N$71
  Top 0.6: XIOL.11 JP6.11
  Bottom 0.6: JP6.11 115.57,132.08 128.91,121.28 HALL6.3
N$72
  Top 0.6: XIOL.9 JP6.12
  Bottom 0.6: HALL5.3 128.91,116.2 114.94,129.54 JP6.12
N$73
  Top 0.6: XIOL.7 JP6.13
  Bottom 0.6: JP6.13 113.67,127 128.91,111.12 HALL4.3
N$74
  Top 0.6: XIOL.5 JP6.14
  Bottom 0.6: JP6.14 112.4,124.46 127,106.05 HALL3.3
N$75
  Top 0.6: JP5.16 87.63,116.84 95.25,119.38 XIOL.2
N$76
  Top 0.6: XIOL.1 JP6.16
  Bottom 0.6: HALL1.3 123.19,95.88 109.22,116.84 JP6.16
N$77
  Top 0.6: XIOL.3 JP6.15
  Bottom 0.6: JP6.15 111.12,121.92 125.09,100.97 HALL2.3
N$78
  Top 0.6: XIOH.2 95.25,139.7 87.63,137.16 JP5.8
  Bottom 0.6: CLAMPS_DRIVER.11 71.76,137.16 75.56,141.6 80.01,141.6 84.45,137.16 JP5.8
N$79
  Bottom 0.813: CARRIAGE_CLAMP.1 26.67,153.03 37.46,154.94 CLAMPS_DRIVER.1
N$80
  Bottom 0.813: PNEU_DRIVER.17 128.91,158.12 140.97,170.81 SWING_PULLING.1
N$81
  Bottom 0.813: PNEU_DRIVER.16 130.81,155.57 142.88,165.73 146.69,165.73 ARM_CYLINDER.2
N$82
  Bottom 0.813: PNEU_DRIVER.15 132.72,153.03 142.88,160.66 ARM_CYLINDER.1
N$83
  Bottom 0.813: SLIDER.2 145.41,155.57 135.89,150.5 PNEU_DRIVER.14
N$84
  Bottom 0.813: PNEU_DRIVER.13 131.44,147.32 140.97,147.32 145.41,150.5 SLIDER.1
N$85
  Bottom 0.813: CARRIAGE.2 145.41,145.41 142.24,142.88 133.35,142.88 128.27,145.41 PNEU_DRIVER.12
N$86
  Bottom 0.813: PNEU_DRIVER.11 128.27,142.88 133.35,139.06 141.6,139.06 146.05,140.34 CARRIAGE.1
N$87
  Bottom 0.813: CLAMPS_DRIVER.2 43.18,152.4 26.67,148.59 CARRIAGE_CLAMP.2
N$88
  Bottom 0.813: HOLDING_MAGNET.1 26.67,142.88 45.08,149.86 CLAMPS_DRIVER.3
N$89
  Bottom 0.813: HOLDING_MAGNET.2 26.04,137.79 46.99,147.32 CLAMPS_DRIVER.4
N$90
  Bottom 0.813: A.1 26.04,132.72 47.62,144.78 CLAMPS_DRIVER.5
N$91
  Bottom 0.813: A.2 26.04,127.63 49.53,142.24 CLAMPS_DRIVER.6
N$92
  Bottom 0.813: CLAMPS_DRIVER.7 50.8,139.7 25.4,122.56 B.1
N$93
  Bottom 0.813: B.2 26.04,117.47 52.07,137.16 CLAMPS_DRIVER.8
N$96
  Top 0.6: R1.2 35.56,78.1 LED8.A
N$97
  Top 0.6: R3.2 133.08,72.81 LED3.A
N$98
  Top 0.6: LED4.A R4.2
N$99
  Top 0.6: LED9.A 79.75,59.84 R5.2
N$100
  Top 0.6: R6.2 5V_GENERATOR.3
  Bottom 1.27: 5V_GENERATOR.3 MOTOR_DRIVER1.3 5V.1 5V.2 5V.3 5V.4 5V.5 5V.6 5V.7 5V.8 5V.9 5V.10
N$101
  Top 0.6: LED5.A R6.1
N$102
  Top 0.61: R9.1 LED6.A
N$103
  Top 0.6: LED1.A R8.1
N$104
  Top 0.6: LED2.A 45.08,129.54 R7.1
N$105
  Top 0.6: ADCH.7 ADCH1.7
N$110
  Bottom 0.6: SV2.20 SV2.19
N$111
  Bottom 0.6: SV1.20 SV1.19
N$114
  Top 0.6: ADCL.6 ADCL1.6
  Bottom 0.6: ADCL1.6 SV2.16 SV2.15
N$116
  Top 0.6: ADCL.4 ADCL1.4
  Bottom 0.6: ADCL1.4 SV2.12 SV2.11
V+
  Top 0.6: LS2_SUPPLY.3 R5.1
  Bottom 1: SV1.4 SV1.3 LS2_SUPPLY.3
VCC
  Top 0.6: LS1_SUPPLY.3 R4.1
  Bottom 1: SV2.4 SV2.3 LS1_SUPPLY.3

### Text on the board
tPlace: 9 | 8 | 7 | 6 | 5 | 4 | 3 | 2 | 1 | 0 | 22 | 14 | 15 | 16 | 17 | 18 | 19 | 20 | 21 | 13 | 12 | 11 | 10 | 24 | 26 | 28 | 30 | 31 | 32 | 33 | 34 | 35 | 36 | 37 | 38 | 39 | 40 | 41 | 42 | 43 | 44 | 45 | 46 | 47 | 48 | 49 | 50 | 51 | 52 | 53 | 0 | 1 | 2 | 3 | 4 | 5 | 6 | 7 | 8 | 9 | 10 | 11 | 12 | 13 | 14 | 15
tNames: 5V | GND | AREF | TX | RX | TX3 | RX3 | TX2 | RX2 | TX1 | RX1 | SDA | SCL | GND | RESET | 3V3 | 5V | GND | VIN